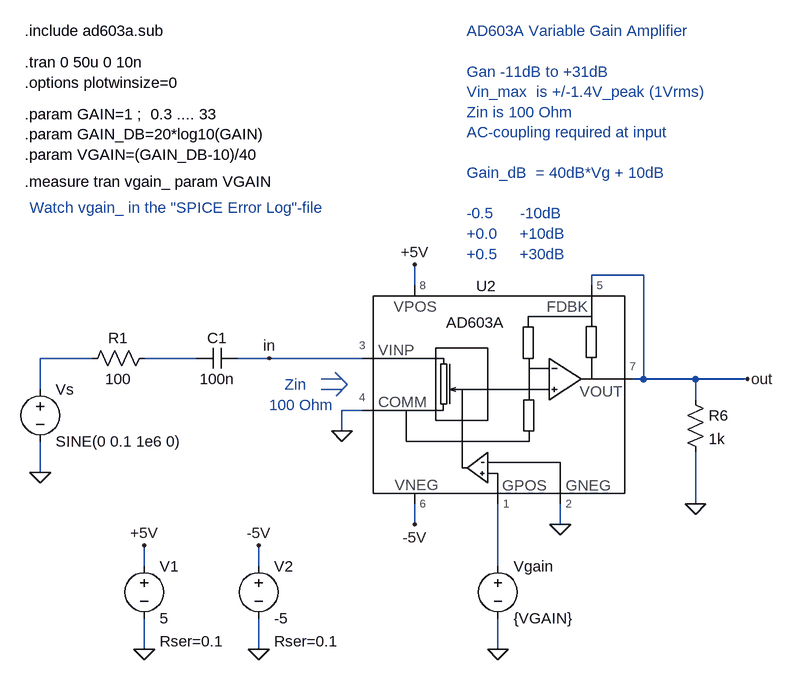
[diagram p0: schematic ad603a_test_.asc]
ad603a_test_.asc, the LTspice schematic file:
Version 4
SHEET 1 2100 1268
WIRE -640 16 -640 -32
WIRE -640 144 -640 96
WIRE -560 -32 -640 -32
WIRE -480 288 -480 256
WIRE -480 416 -480 368
WIRE -400 -32 -480 -32
WIRE -304 288 -304 256
WIRE -304 416 -304 368
WIRE -288 -32 -336 -32
WIRE -176 80 -176 48
WIRE -144 -32 -288 -32
WIRE -144 48 -176 48
WIRE -64 -144 -64 -176
WIRE -64 224 -64 192
WIRE 64 288 64 192
WIRE 64 416 64 368
WIRE 160 224 160 192
WIRE 208 -144 208 -160
WIRE 288 -160 208 -160
WIRE 288 0 272 0
WIRE 288 0 288 -160
WIRE 368 0 288 0
WIRE 368 32 368 0
WIRE 368 192 368 112
WIRE 448 0 368 0
FLAG -480 416 0
FLAG -480 256 +5V
FLAG -304 416 0
FLAG -304 256 -5V
FLAG -64 -176 +5V
FLAG -64 224 -5V
FLAG -176 80 0
FLAG 368 192 0
FLAG 64 416 0
FLAG 160 224 0
FLAG 448 0 out
FLAG -640 144 0
FLAG -288 -32 in
SYMBOL voltage -480 272 R0
WINDOW 123 0 0 Left 0
WINDOW 39 24 132 Left 0
SYMATTR SpiceLine Rser=0.1
SYMATTR InstName V1
SYMATTR Value 5
SYMBOL voltage -304 272 R0
WINDOW 123 0 0 Left 0
WINDOW 39 24 132 Left 0
SYMATTR SpiceLine Rser=0.1
SYMATTR InstName V2
SYMATTR Value -5
SYMBOL res 352 16 R0
SYMATTR InstName R6
SYMATTR Value 1k
SYMBOL voltage 64 272 R0
WINDOW 123 0 0 Left 0
WINDOW 39 0 0 Left 0
SYMATTR InstName Vgain
SYMATTR Value {VGAIN}
SYMBOL cap -400 -16 R270
WINDOW 0 32 32 VTop 0
WINDOW 3 0 32 VBottom 0
SYMATTR InstName C1
SYMATTR Value 100n
SYMBOL res -576 -16 R270
WINDOW 0 32 56 VTop 0
WINDOW 3 0 56 VBottom 0
SYMATTR InstName R1
SYMATTR Value 100
SYMBOL ad603 -112 16 R0
SYMATTR InstName U2
SYMBOL voltage -640 0 R0
WINDOW 123 0 0 Left 0
WINDOW 39 0 0 Left 0
SYMATTR InstName Vs
SYMATTR Value SINE(0 0.1 1e6 0)
TEXT -664 -488 Left 0 !.tran 0 50u 0 10n
TEXT -664 -456 Left 0 !.options plotwinsize=0
TEXT -664 -536 Left 0 !.include ad603a.sub
TEXT 16 -536 Left 0 ;AD603A Variable Gain Amplifier \n \nGan -11dB to +31dB\nVin_max  is +/-1.4V_peak (1Vrms)\nZin is 100 Ohm\nAC-coupling required at input\n \nGain_dB  = 40dB*Vg + 10dB\n \n-0.5      -10dB\n+0.0     +10dB\n+0.5     +30dB
TEXT -664 -408 Left 0 !.param GAIN=1 ;  0.3 .... 33\n.param GAIN_DB=20*log10(GAIN)\n.param VGAIN=(GAIN_DB-10)/40
TEXT -664 -304 Left 0 !.measure tran vgain_ param VGAIN
TEXT -656 -264 Left 0 ;Watch vgain_ in the "SPICE Error Log"-file
TEXT -264 8 Left 0 ;Zin
TEXT -288 40 Left 0 ;100 Ohm
LINE Normal -176 0 -208 0
LINE Normal -176 16 -208 16
LINE Normal -168 8 -185 26
LINE Normal -186 -10 -168 8

The netlist it stands for:
* ad603a_test_.asc
V1 +5V 0 5 Rser=0.1
V2 -5V 0 -5 Rser=0.1
R6 out 0 1k
Vgain N003 0 {VGAIN}
C1 N002 in 100n
R1 N001 N002 100
XU2 in 0 +5V -5V out N003 0 out AD603A  ; pins 3 4 8 6 7 1 2 5
Vs N001 0 SINE(0 0.1 1e6 0)
.tran 0 50u 0 10n
.options plotwinsize=0
.include ad603a.sub
* AD603A Variable Gain Amplifier
* Gan -11dB to +31dB
* Vin_max  is +/-1.4V_peak (1Vrms)
* Zin is 100 Ohm
* AC-coupling required at input
* Gain_dB  = 40dB*Vg + 10dB
* -0.5      -10dB
* +0.0     +10dB
* +0.5     +30dB
.param GAIN=1 ;  0.3 .... 33
.param GAIN_DB=20*log10(GAIN)
.param VGAIN=(GAIN_DB-10)/40
.measure tran vgain_ param VGAIN
* Watch vgain_ in the "SPICE Error Log"-file
* Zin
* 100 Ohm
.backanno
.end